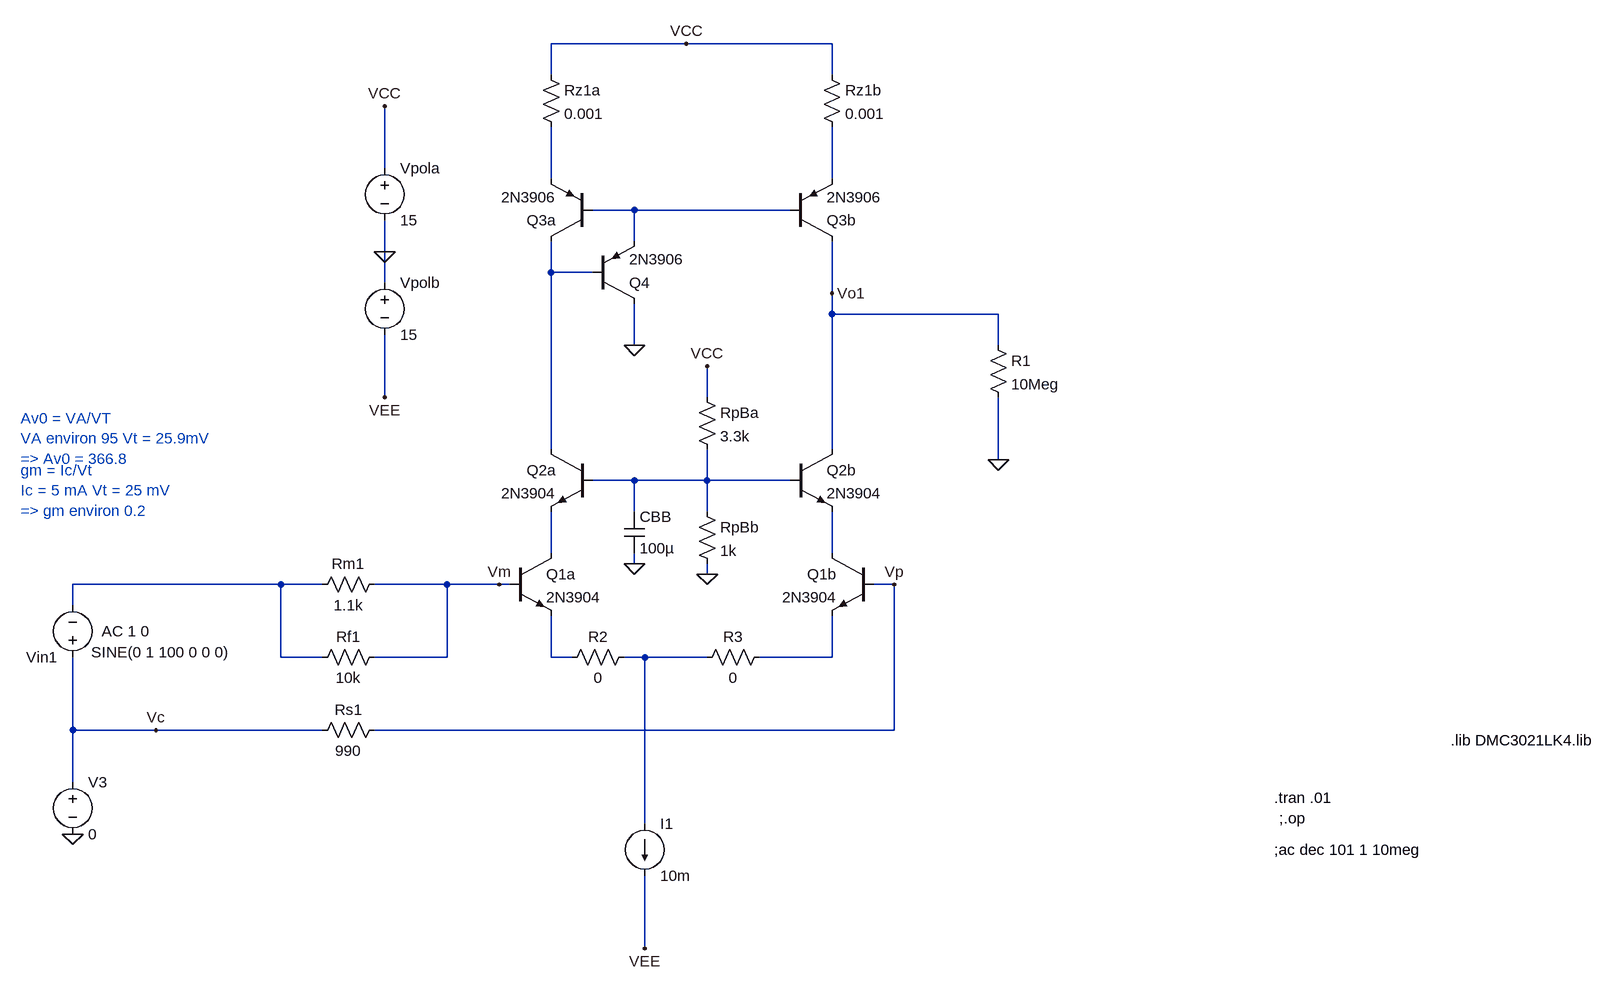
[diagram p0: schematic LT_ETAGE_1_SIMPLIFIE.asc]
LT_ETAGE_1_SIMPLIFIE.asc, the LTspice schematic file:
Version 4
SHEET 1 2404 1432
WIRE 288 -464 80 -464
WIRE 512 -464 288 -464
WIRE 80 -416 80 -464
WIRE 512 -416 512 -464
WIRE -176 -272 -176 -368
WIRE 80 -256 80 -336
WIRE 512 -256 512 -336
WIRE 208 -208 144 -208
WIRE 448 -208 208 -208
WIRE 208 -160 208 -208
WIRE -176 -144 -176 -192
WIRE 80 -112 80 -160
WIRE 144 -112 80 -112
WIRE -176 -96 -176 -144
WIRE 512 -80 512 -160
WIRE 512 -48 512 -80
WIRE 768 -48 512 -48
WIRE 208 0 208 -64
WIRE 768 0 768 -48
WIRE -176 80 -176 -16
WIRE 320 80 320 32
WIRE 80 160 80 -112
WIRE 512 160 512 -48
WIRE 768 176 768 80
WIRE 208 208 144 208
WIRE 320 208 320 160
WIRE 320 208 208 208
WIRE 448 208 320 208
WIRE 208 256 208 208
WIRE 320 256 320 208
WIRE 80 320 80 256
WIRE 512 320 512 256
WIRE 208 336 208 320
WIRE 320 352 320 336
WIRE -336 368 -656 368
WIRE -272 368 -336 368
WIRE -80 368 -192 368
WIRE 0 368 -80 368
WIRE 16 368 0 368
WIRE 608 368 576 368
WIRE -656 400 -656 368
WIRE -336 480 -336 368
WIRE -272 480 -336 480
WIRE -80 480 -80 368
WIRE -80 480 -192 480
WIRE 80 480 80 416
WIRE 112 480 80 480
WIRE 224 480 192 480
WIRE 320 480 224 480
WIRE 512 480 512 416
WIRE 512 480 400 480
WIRE -656 592 -656 480
WIRE -528 592 -656 592
WIRE -272 592 -528 592
WIRE 608 592 608 368
WIRE 608 592 -192 592
WIRE -656 672 -656 592
WIRE 224 736 224 480
WIRE 224 928 224 816
FLAG 288 -464 VCC
FLAG -176 -368 VCC
FLAG -176 80 VEE
FLAG -176 -144 0
FLAG 512 -80 Vo1
FLAG 608 368 Vp
FLAG 208 0 0
FLAG 224 928 VEE
FLAG 0 368 Vm
FLAG -656 752 0
FLAG -528 592 Vc
FLAG 320 352 0
FLAG 320 32 VCC
FLAG 208 336 0
FLAG 768 176 0
SYMBOL npn 16 320 R0
SYMATTR InstName Q1a
SYMATTR Value 2N3904
SYMBOL npn 576 320 M0
SYMATTR InstName Q1b
SYMATTR Value 2N3904
SYMBOL npn 448 160 R0
SYMATTR InstName Q2b
SYMATTR Value 2N3904
SYMBOL npn 144 160 M0
SYMATTR InstName Q2a
SYMATTR Value 2N3904
SYMBOL pnp 144 -160 R180
SYMATTR InstName Q3a
SYMATTR Value 2N3906
SYMBOL pnp 144 -64 M180
SYMATTR InstName Q4
SYMATTR Value 2N3906
SYMBOL pnp 448 -160 M180
SYMATTR InstName Q3b
SYMATTR Value 2N3906
SYMBOL res 64 -432 R0
SYMATTR InstName Rz1a
SYMATTR Value 0.001
SYMBOL res 496 -432 R0
SYMATTR InstName Rz1b
SYMATTR Value 0.001
SYMBOL voltage -176 -288 R0
WINDOW 123 0 0 Left 0
WINDOW 39 0 0 Left 0
SYMATTR InstName Vpola
SYMATTR Value 15
SYMBOL voltage -176 -112 R0
WINDOW 123 0 0 Left 0
WINDOW 39 0 0 Left 0
SYMATTR InstName Vpolb
SYMATTR Value 15
SYMBOL current 224 736 R0
WINDOW 123 0 0 Left 0
WINDOW 39 0 0 Left 0
SYMATTR InstName I1
SYMATTR Value 10m
SYMBOL res 208 464 R90
WINDOW 0 0 56 VBottom 2
WINDOW 3 32 56 VTop 2
SYMATTR InstName R2
SYMATTR Value 0
SYMBOL res 416 464 R90
WINDOW 0 0 56 VBottom 2
WINDOW 3 32 56 VTop 2
SYMATTR InstName R3
SYMATTR Value 0
SYMBOL res 752 -16 R0
SYMATTR InstName R1
SYMATTR Value 10Meg
SYMBOL res -176 576 R90
WINDOW 0 0 56 VBottom 2
WINDOW 3 32 56 VTop 2
SYMATTR InstName Rs1
SYMATTR Value 990
SYMBOL res -176 352 R90
WINDOW 0 0 56 VBottom 2
WINDOW 3 32 56 VTop 2
SYMATTR InstName Rm1
SYMATTR Value 1.1k
SYMBOL res -176 464 R90
WINDOW 0 0 56 VBottom 2
WINDOW 3 32 56 VTop 2
SYMATTR InstName Rf1
SYMATTR Value 10k
SYMBOL voltage -656 656 R0
WINDOW 123 0 0 Left 0
WINDOW 39 0 0 Left 0
SYMATTR InstName V3
SYMATTR Value 0
SYMBOL voltage -656 496 R180
WINDOW 123 -118 56 Left 2
WINDOW 39 0 0 Left 0
WINDOW 3 -242 24 Left 2
SYMATTR Value2 AC 1 0
SYMATTR Value SINE(0 1 100 0 0 0)
SYMATTR InstName Vin1
SYMBOL res 304 240 R0
SYMATTR InstName RpBb
SYMATTR Value 1k
SYMBOL res 304 64 R0
SYMATTR InstName RpBa
SYMATTR Value 3.3k
SYMBOL cap 192 256 R0
SYMATTR InstName CBB
SYMATTR Value 100µ
TEXT 1200 728 Left 2 !;.op
TEXT 1192 776 Left 2 !;ac dec 101 1 10meg
TEXT 1192 696 Left 2 !.tran .01
TEXT 1464 608 Left 2 !.lib DMC3021LK4.lib
TEXT -736 112 Left 2 ;Av0 = VA/VT \nVA environ 95 Vt = 25.9mV \n=> Av0 = 366.8
TEXT -736 192 Left 2 ;gm = Ic/Vt  \nIc = 5 mA Vt = 25 mV \n=> gm environ 0.2

The netlist it stands for:
* LT_ETAGE_1_SIMPLIFIE.asc
Q1a N006 Vm N009 0 2N3904
Q1b N007 Vp N011 0 2N3904
Q2b Vo1 N005 N007 0 2N3904
Q2a N004 N005 N006 0 2N3904
Q3a N004 N003 N001 0 2N3906
Q4 0 N004 N003 0 2N3906
Q3b Vo1 N003 N002 0 2N3906
Rz1a VCC N001 0.001
Rz1b VCC N002 0.001
Vpola VCC 0 15
Vpolb 0 VEE 15
I1 N010 VEE 10m
R2 N010 N009 0
R3 N011 N010 0
R1 Vo1 0 10Meg
Rs1 Vp Vc 990
Rm1 Vm N008 1.1k
Rf1 Vm N008 10k
V3 Vc 0 0
Vin1 Vc N008 SINE(0 1 100 0 0 0) AC 1 0
RpBb N005 0 1k
RpBa VCC N005 3.3k
CBB N005 0 100µ
.model NPN NPN
.model PNP PNP
.lib standard.bjt
;.op
;ac dec 101 1 10meg
.tran .01
.lib DMC3021LK4.lib
* Av0 = VA/VT
* VA environ 95 Vt = 25.9mV
* => Av0 = 366.8
* gm = Ic/Vt
* Ic = 5 mA Vt = 25 mV
* => gm environ 0.2
.backanno
.end